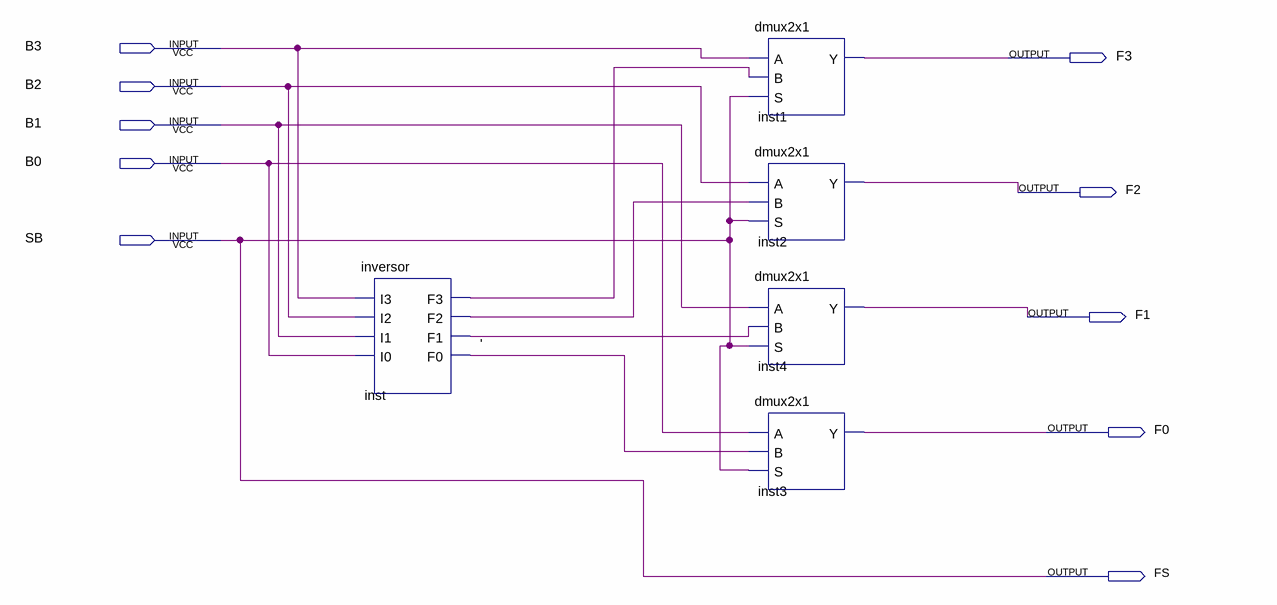
[diagram p0: schematic sheet]
// Quartus schematic comp2.bdf as structural Verilog: 5 symbols, 10 pins
module comp2 (
  input  B3,
  input  B2,
  input  B1,
  input  B0,
  input  SB,
  output F3,
  output F2,
  output F1,
  output F0,
  output FS
);

  wire \' , inst_f1, inst_f2, inst_f3;

  inversor inst (.I3(B3), .I2(B2), .I1(B1), .I0(B0), .F3(inst_f3), .F2(inst_f2), .F1(inst_f1), .F0(\' ));
  dmux2x1 inst1 (.A(B3), .B(inst_f3), .S(SB), .Y(F3));
  dmux2x1 inst2 (.A(B2), .B(inst_f2), .S(SB), .Y(F2));
  dmux2x1 inst4 (.A(B1), .B(inst_f1), .S(SB), .Y(F1));
  dmux2x1 inst3 (.A(B0), .B(\' ), .S(SB), .Y(F0));

  assign FS = SB;
endmodule
